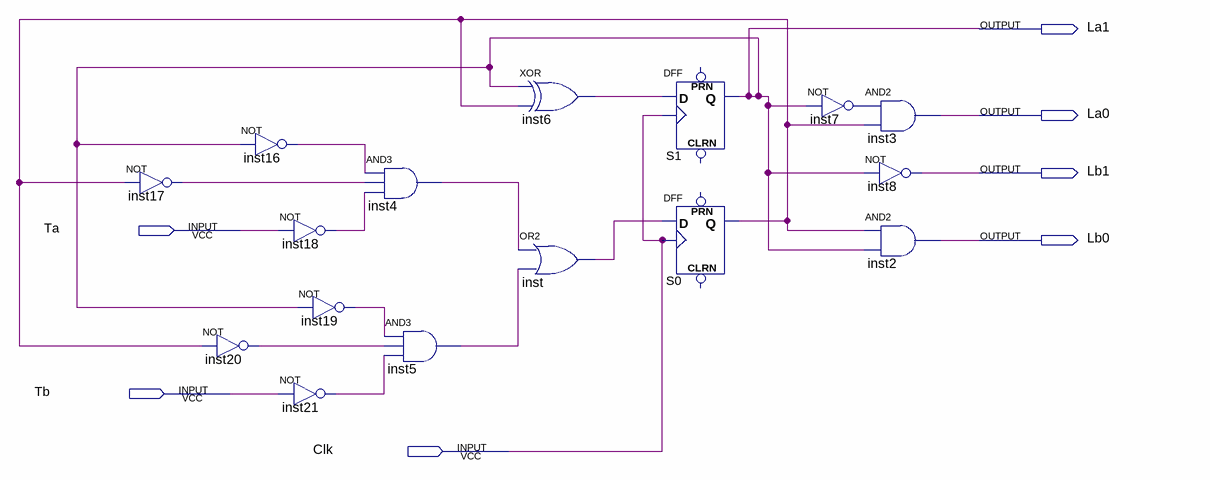
[diagram p0: schematic sheet]
// Quartus schematic Ex_34.bdf as structural Verilog: 16 symbols, 7 pins
module Ex_34 (
  input  Ta,
  input  Tb,
  input  Clk,
  output La1,
  output La0,
  output Lb1,
  output Lb0
);

  wire inst4_out, inst5_out, inst6_out, inst7_out, inst16_out, inst17_out, inst18_out, inst19_out,
       inst20_out, inst21_out, inst_out, S0_q;

  not inst17 (inst17_out, S0_q);
  not inst16 (inst16_out, La1);
  not inst20 (inst20_out, S0_q);
  not inst18 (inst18_out, Ta);
  not inst19 (inst19_out, La1);
  not inst21 (inst21_out, Tb);
  and inst4 (inst4_out, inst16_out, inst17_out, inst18_out);
  and inst5 (inst5_out, inst19_out, inst20_out, inst21_out);
  xor inst6 (inst6_out, La1, S0_q);
  or inst (inst_out, inst4_out, inst5_out);
  DFF S1 (.CLK(Clk), .D(inst6_out), .Q(La1));  // open: CLRN, PRN
  DFF S0 (.CLK(Clk), .D(inst_out), .Q(S0_q));  // open: CLRN, PRN
  and inst3 (La0, inst7_out, S0_q);
  not inst7 (inst7_out, La1);
  not inst8 (Lb1, La1);
  and inst2 (Lb0, S0_q, La1);
endmodule
